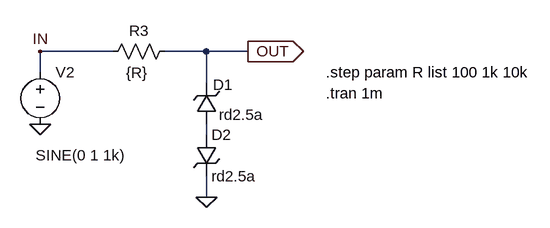
[diagram p0: schematic Limiter.asc]
Limiter.asc, the LTspice schematic file:
Version 4
SHEET 1 880 680
WIRE 128 -64 16 -64
WIRE 272 -64 208 -64
WIRE 336 -64 272 -64
WIRE 16 -32 16 -64
WIRE 272 -16 272 -64
WIRE 272 64 272 48
WIRE 272 160 272 128
FLAG 16 48 0
FLAG 336 -64 OUT
IOPIN 336 -64 Out
FLAG 272 160 0
FLAG 16 -64 IN
SYMBOL voltage 16 -48 R0
WINDOW 3 -7 144 Left 2
WINDOW 123 0 0 Left 2
WINDOW 39 0 0 Left 2
SYMATTR Value SINE(0 1 1k)
SYMATTR InstName V2
SYMBOL res 224 -80 R90
WINDOW 0 0 56 VBottom 2
WINDOW 3 64 59 VBottom 2
SYMATTR InstName R3
SYMATTR Value {R}
SYMBOL zener 288 48 R180
WINDOW 0 -25 61 Left 2
WINDOW 3 -72 15 Left 2
SYMATTR InstName D1
SYMATTR Value rd2.5a
SYMBOL zener 256 64 R0
SYMATTR InstName D2
SYMATTR Value rd2.5a
TEXT 456 0 Left 2 !.tran 1m
TEXT 456 -32 Left 2 !.step param R list 100 1k 10k

The netlist it stands for:
* Limiter.asc
V2 IN 0 SINE(0 1 1k)
R3 OUT IN {R}
D1 N001 OUT rd2.5a
D2 N001 0 rd2.5a
.model D D
.lib standard.dio
.tran 1m
.step param R list 100 1k 10k
.backanno
.end